# EAGLE design usb_hub_asic (EAGLE 9.6.2)
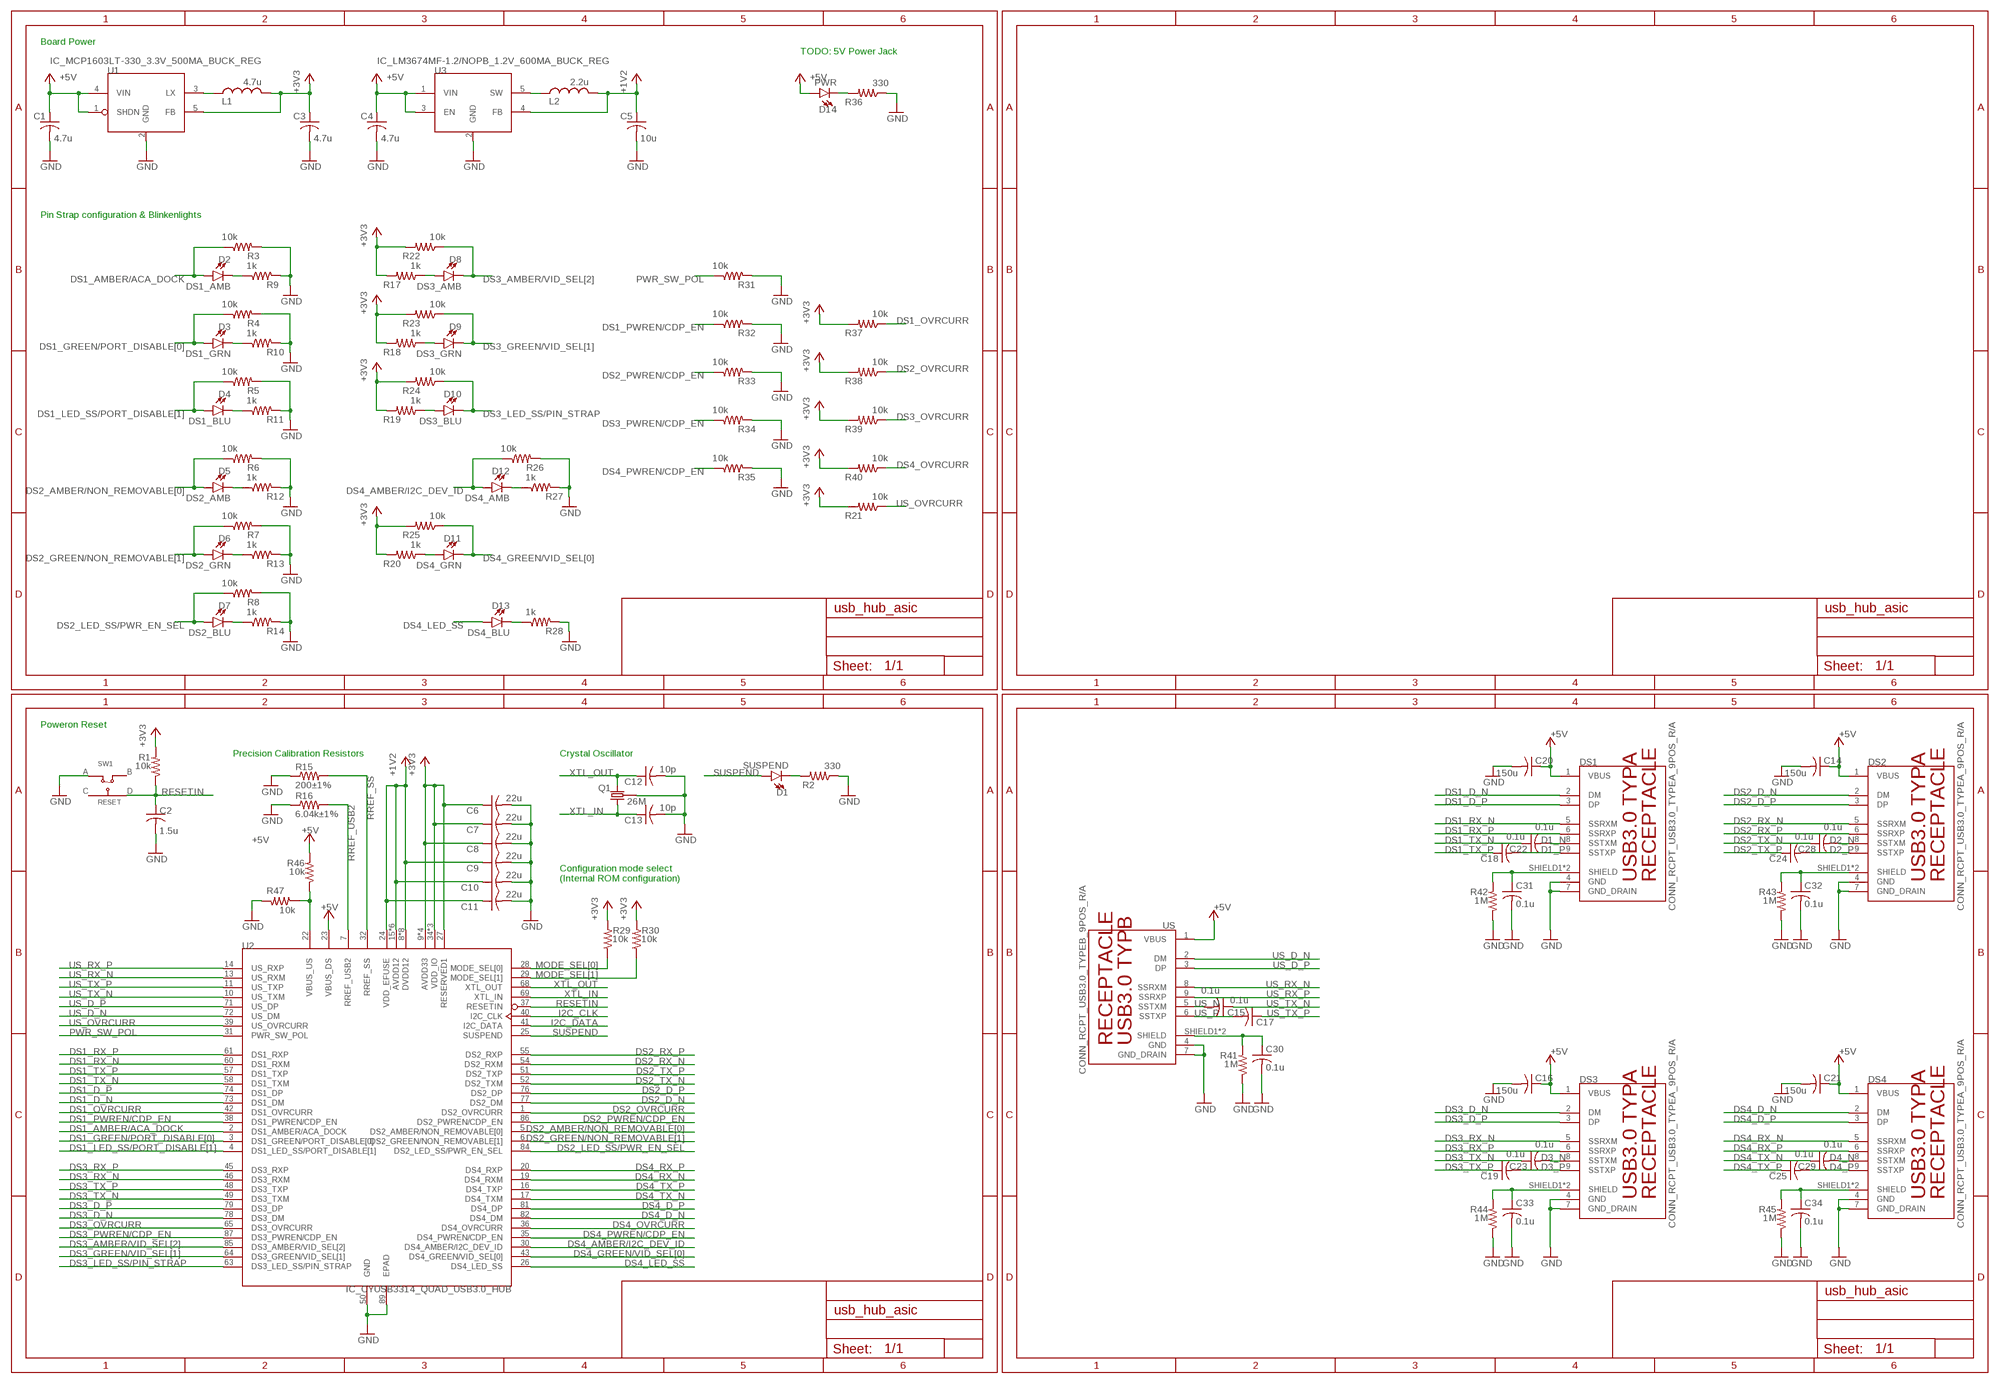
[diagram p0: schematic, sheet 1]

## Parts
C1  4.7u  C-USC0603  [C0603]
C2  1.5u  C-USC0603  [C0603]
C3  4.7u  C-USC0603  [C0603]
C4  4.7u  C-USC0603  [C0603]
C5  10u  C-USC0805  [C0805]
C6  22u  C-USC0603  [C0603]
C7  22u  C-USC0603  [C0603]
C8  22u  C-USC0603  [C0603]
C9  22u  C-USC0603  [C0603]
C10  22u  C-USC0603  [C0603]
C11  22u  C-USC0603  [C0603]
C12  10p  C-USC0603  [C0603]
C13  10p  C-USC0603  [C0603]
C14  150u  C-USC1210K  [C1210K]
C15  0.1u  C-USC0603  [C0603]
C16  150u  C-USC1210K  [C1210K]
C17  0.1u  C-USC0603  [C0603]
C18  0.1u  C-USC0603  [C0603]
C19  0.1u  C-USC0603  [C0603]
C20  150u  C-USC1210K  [C1210K]
C21  150u  C-USC1210K  [C1210K]
C22  0.1u  C-USC0603  [C0603]
C23  0.1u  C-USC0603  [C0603]
C24  0.1u  C-USC0603  [C0603]
C25  0.1u  C-USC0603  [C0603]
C28  0.1u  C-USC0603  [C0603]
C29  0.1u  C-USC0603  [C0603]
C30  0.1u  C-USC0603  [C0603]
C31  0.1u  C-USC0603  [C0603]
C32  0.1u  C-USC0603  [C0603]
C33  0.1u  C-USC0603  [C0603]
C34  0.1u  C-USC0603  [C0603]
D1  SUSPEND  LED1206  [LED-1206]
D2  DS1_AMB  LED-RED1206  [LED-1206]
D3  DS1_GRN  LED-GREEN1206  [LED-1206]
D4  DS1_BLU  LED-BLUE1206  [LED-1206]
D5  DS2_AMB  LED-RED1206  [LED-1206]
D6  DS2_GRN  LED-GREEN1206  [LED-1206]
D7  DS2_BLU  LED-BLUE1206  [LED-1206]
D8  DS3_AMB  LED-RED1206  [LED-1206]
D9  DS3_GRN  LED-GREEN1206  [LED-1206]
D10  DS3_BLU  LED-BLUE1206  [LED-1206]
D11  DS4_GRN  LED-GREEN1206  [LED-1206]
D12  DS4_AMB  LED-RED1206  [LED-1206]
D13  DS4_BLU  LED-BLUE1206  [LED-1206]
D14  PWR  LED1206  [LED-1206]
DS1  CONN_RCPT_USB3.0_TYPEA_9POS_R/A  [CONN_RCPT_USB3.0_UJ3-AH-4-TH]
DS2  CONN_RCPT_USB3.0_TYPEA_9POS_R/A  [CONN_RCPT_USB3.0_UJ3-AH-4-TH]
DS3  CONN_RCPT_USB3.0_TYPEA_9POS_R/A  [CONN_RCPT_USB3.0_UJ3-AH-4-TH]
DS4  CONN_RCPT_USB3.0_TYPEA_9POS_R/A  [CONN_RCPT_USB3.0_UJ3-AH-4-TH]
L1  4.7u  L_4.7UH_1.5A_SMD_1212(3030METRIC)  [SMD-1212(3030METRIC)]
L2  2.2u  L_2.2UH_1.3A_SMD_0805(2012METRIC)  [SMD-0805(2012METRIC)]
Q1  26M  XTAL_26MHZ_4-SMD_ECX-42  [4-SMD-ECS-260-13-42-CKM-TR]
R1  10k  R-US_R0603  [R0603]
R2  330  R-US_R0603  [R0603]
R3  10k  R-US_R0603  [R0603]
R4  10k  R-US_R0603  [R0603]
R5  10k  R-US_R0603  [R0603]
R6  10k  R-US_R0603  [R0603]
R7  10k  R-US_R0603  [R0603]
R8  10k  R-US_R0603  [R0603]
R9  1k  R-US_R0603  [R0603]
R10  1k  R-US_R0603  [R0603]
R11  1k  R-US_R0603  [R0603]
R12  1k  R-US_R0603  [R0603]
R13  1k  R-US_R0603  [R0603]
R14  1k  R-US_R0603  [R0603]
R15  200±1%  R-US_R0603  [R0603]
R16  6.04k±1%  R-US_R0603  [R0603]
R17  1k  R-US_R0603  [R0603]
R18  1k  R-US_R0603  [R0603]
R19  1k  R-US_R0603  [R0603]
R20  1k  R-US_R0603  [R0603]
R21  10k  R-US_R0603  [R0603]
R22  10k  R-US_R0603  [R0603]
R23  10k  R-US_R0603  [R0603]
R24  10k  R-US_R0603  [R0603]
R25  10k  R-US_R0603  [R0603]
R26  10k  R-US_R0603  [R0603]
R27  1k  R-US_R0603  [R0603]
R28  1k  R-US_R0603  [R0603]
R29  10k  R-US_R0603  [R0603]
R30  10k  R-US_R0603  [R0603]
R31  10k  R-US_R0603  [R0603]
R32  10k  R-US_R0603  [R0603]
R33  10k  R-US_R0603  [R0603]
R34  10k  R-US_R0603  [R0603]
R35  10k  R-US_R0603  [R0603]
R36  330  R-US_R0603  [R0603]
R37  10k  R-US_R0603  [R0603]
R38  10k  R-US_R0603  [R0603]
R39  10k  R-US_R0603  [R0603]
R40  10k  R-US_R0603  [R0603]
R41  1M  R-US_R0603  [R0603]
R42  1M  R-US_R0603  [R0603]
R43  1M  R-US_R0603  [R0603]
R44  1M  R-US_R0603  [R0603]
R45  1M  R-US_R0603  [R0603]
R46  10k  R-US_R0603  [R0603]
R47  10k  R-US_R0603  [R0603]
SW1  RESET  SW_SPDT_TLSMDT3C020GLFS  [SMD-TLSMDT3C020GLFS]
U1  IC_MCP1603LT-330_3.3V_500MA_BUCK_REG  [5-TSOT23]
U2  IC_CYUSB3314_QUAD_USB3.0_HUB  [88-QFN_10X10X1_5.3_TPAD]
U3  IC_LM3674MF-1.2/NOPB_1.2V_600MA_BUCK_REG  [5-TSOT23]
US  CONN_RCPT_USB3.0_TYPEB_9POS_R/A  [CONN_RCPT_USB3.0_E8199-030-03]

## Nets
+1V2: C5.1 C9.1 C10.1 C11.1 L2.P$2 U2.8(DVDD12) U2.12(DVDD12) U2.15(AVDD12) U2.18(DVDD12) U2.21(AVDD12) U2.24(VDD_EFUSE) U2.33(DVDD12) U2.44(AVDD12) U2.47(DVDD12) U2.53(DVDD12) U2.56(AVDD12) U2.59(DVDD12) U2.62(AVDD12) U2.67(AVDD12) U2.83(DVDD12) U3.4(FB)
+3V3: C3.1 C6.1 C7.1 C8.1 L1.P$2 R1.2 R17.2 R18.2 R19.2 R20.2 R21.2 R22.2 R23.2 R24.2 R25.2 R29.2 R30.2 R37.2 R38.2 R39.2 R40.2 U1.5(FB) U2.9(AVDD33) U2.27(RESERVED1) U2.34(VDD_IO) U2.66(VDD_IO) U2.70(AVDD33) U2.75(AVDD33) U2.80(AVDD33) U2.88(VDD_IO)
+5V: C1.1 C4.1 C14.1 C16.1 C20.1 C21.1 D14.A DS1.1(VBUS) DS2.1(VBUS) DS3.1(VBUS) DS4.1(VBUS) R46.2 U1.1(SHDN) U1.4(VIN) U2.23(VBUS_DS) U3.1(VIN) U3.3(EN) US.1(VBUS)
D1_N: C22.2 DS1.8(SSTXM)
D1_P: C18.2 DS1.9(SSTXP)
D2_N: C28.2 DS2.8(SSTXM)
D2_P: C24.2 DS2.9(SSTXP)
D3_N: C23.2 DS3.8(SSTXM)
D3_P: C19.2 DS3.9(SSTXP)
D4_N: C29.2 DS4.8(SSTXM)
D4_P: C25.2 DS4.9(SSTXP)
DS1_AMBER/ACA_DOCK: D2.A R3.1 U2.2(DS1_AMBER/ACA_DOCK)
DS1_D_N: DS1.2(DM) U2.73(DS1_DM)
DS1_D_P: DS1.3(DP) U2.74(DS1_DP)
DS1_GREEN/PORT_DISABLE[0]: D3.A R4.1 U2.3(DS1_GREEN/PORT_DISABLE[0])
DS1_LED_SS/PORT_DISABLE[1]: D4.A R5.1 U2.4(DS1_LED_SS/PORT_DISABLE[1])
DS1_OVRCURR: R37.1 U2.42(DS1_OVRCURR)
DS1_PWREN/CDP_EN: R32.1 U2.38(DS1_PWREN/CDP_EN)
DS1_RX_N: DS1.5(SSRXM) U2.60(DS1_RXM)
DS1_RX_P: DS1.6(SSRXP) U2.61(DS1_RXP)
DS1_TX_N: C22.1 U2.58(DS1_TXM)
DS1_TX_P: C18.1 U2.57(DS1_TXP)
DS2_AMBER/NON_REMOVABLE[0]: D5.A R6.1 U2.5(DS2_AMBER/NON_REMOVABLE[0])
DS2_D_N: DS2.2(DM) U2.77(DS2_DM)
DS2_D_P: DS2.3(DP) U2.76(DS2_DP)
DS2_GREEN/NON_REMOVABLE[1]: D6.A R7.1 U2.6(DS2_GREEN/NON_REMOVABLE[1])
DS2_LED_SS/PWR_EN_SEL: D7.A R8.1 U2.84(DS2_LED_SS/PWR_EN_SEL)
DS2_OVRCURR: R38.1 U2.1(DS2_OVRCURR)
DS2_PWREN/CDP_EN: R33.1 U2.86(DS2_PWREN/CDP_EN)
DS2_RX_N: DS2.5(SSRXM) U2.54(DS2_RXM)
DS2_RX_P: DS2.6(SSRXP) U2.55(DS2_RXP)
DS2_TX_N: C28.1 U2.52(DS2_TXM)
DS2_TX_P: C24.1 U2.51(DS2_TXP)
DS3_AMBER/VID_SEL[2]: D8.C R22.1 U2.85(DS3_AMBER/VID_SEL[2])
DS3_D_N: DS3.2(DM) U2.78(DS3_DM)
DS3_D_P: DS3.3(DP) U2.79(DS3_DP)
DS3_GREEN/VID_SEL[1]: D9.C R23.1 U2.64(DS3_GREEN/VID_SEL[1])
DS3_LED_SS/PIN_STRAP: D10.C R24.1 U2.63(DS3_LED_SS/PIN_STRAP)
DS3_OVRCURR: R39.1 U2.65(DS3_OVRCURR)
DS3_PWREN/CDP_EN: R34.1 U2.87(DS3_PWREN/CDP_EN)
DS3_RX_N: DS3.5(SSRXM) U2.46(DS3_RXM)
DS3_RX_P: DS3.6(SSRXP) U2.45(DS3_RXP)
DS3_TX_N: C23.1 U2.49(DS3_TXM)
DS3_TX_P: C19.1 U2.48(DS3_TXP)
DS4_AMBER/I2C_DEV_ID: D12.A R26.1 U2.30(DS4_AMBER/I2C_DEV_ID)
DS4_D_N: DS4.2(DM) U2.82(DS4_DM)
DS4_D_P: DS4.3(DP) U2.81(DS4_DP)
DS4_GREEN/VID_SEL[0]: D11.C R25.1 U2.43(DS4_GREEN/VID_SEL[0])
DS4_LED_SS: D13.A U2.26(DS4_LED_SS)
DS4_OVRCURR: R40.1 U2.36(DS4_OVRCURR)
DS4_PWREN/CDP_EN: R35.1 U2.35(DS4_PWREN/CDP_EN)
DS4_RX_N: DS4.5(SSRXM) U2.19(DS4_RXM)
DS4_RX_P: DS4.6(SSRXP) U2.20(DS4_RXP)
DS4_TX_N: C29.1 U2.17(DS4_TXM)
DS4_TX_P: C25.1 U2.16(DS4_TXP)
GND: C1.2 C2.2 C3.2 C4.2 C5.2 C6.2 C7.2 C8.2 C9.2 C10.2 C11.2 C12.2 C13.2 C14.2 C16.2 C20.2 C21.2 C30.2 C31.2 C32.2 C33.2 C34.2 DS1.4(GND) DS1.7(GND_DRAIN) DS2.4(GND) DS2.7(GND_DRAIN) DS3.4(GND) DS3.7(GND_DRAIN) DS4.4(GND) DS4.7(GND_DRAIN) Q1.P$2(GND) Q1.P$4(GND) R2.1 R3.2 R4.2 R5.2 R6.2 R7.2 R8.2 R9.2 R10.2 R11.2 R12.2 R13.2 R14.2 R15.1 R16.1 R26.2 R27.2 R28.2 R31.2 R32.2 R33.2 R34.2 R35.2 R36.1 R41.1 R42.1 R43.1 R44.1 R45.1 R47.2 SW1.A U1.2(GND) U2.50(GND) U2.89(EPAD) U3.2(GND) US.4(GND) US.7(GND_DRAIN)
I2C_CLK: U2.40(I2C_CLK)
I2C_DATA: U2.41(I2C_DATA)
MODE_SEL[0]: R29.1 U2.28(MODE_SEL[0])
MODE_SEL[1]: R30.1 U2.29(MODE_SEL[1])
N$7: D1.C R2.2
N$8: D14.C R36.2
N$11: D2.C R9.1
N$15: D5.C R12.1
N$16: D3.C R10.1
N$20: D6.C R13.1
N$21: D4.C R11.1
N$23: D7.C R14.1
N$24: D10.A R19.1
N$25: D9.A R18.1
N$26: D8.A R17.1
N$27: D12.C R27.1
N$28: L2.P$1 U3.5(SW)
N$29: D13.C R28.1
N$30: L1.P$1 U1.3(LX)
N$32: D11.A R20.1
N$36: R46.1 R47.1 U2.22(VBUS_US)
N$37: C30.1 R41.2 US.SHIELD1(SHIELD) US.SHIELD2(SHIELD)
N$38: C31.1 DS1.SHIELD1(SHIELD) DS1.SHIELD2(SHIELD) R42.2
N$39: C32.1 DS2.SHIELD1(SHIELD) DS2.SHIELD2(SHIELD) R43.2
N$40: C33.1 DS3.SHIELD1(SHIELD) DS3.SHIELD2(SHIELD) R44.2
N$41: C34.1 DS4.SHIELD1(SHIELD) DS4.SHIELD2(SHIELD) R45.2
PWR_SW_POL: R31.1 U2.31(PWR_SW_POL)
RESETIN: C2.1 R1.1 SW1.D U2.37(RESETIN)
RREF_SS: R15.2 U2.32(RREF_SS)
RREF_USB2: R16.2 U2.7(RREF_USB2)
SUSPEND: D1.A U2.25(SUSPEND)
US_D_N: U2.72(US_DM) US.2(DM)
US_D_P: U2.71(US_DP) US.3(DP)
US_N: C15.2 US.5(SSTXM)
US_OVRCURR: R21.1 U2.39(US_OVRCURR)
US_P: C17.2 US.6(SSTXP)
US_RX_N: U2.13(US_RXM) US.8(SSRXM)
US_RX_P: U2.14(US_RXP) US.9(SSRXP)
US_TX_N: C15.1 U2.10(US_TXM)
US_TX_P: C17.1 U2.11(US_TXP)
XTL_IN: C13.1 Q1.P$1 U2.69(XTL_IN)
XTL_OUT: C12.1 Q1.P$3 U2.68(XTL_OUT)
Unconnected: SW1.B SW1.C

## Notes on the sheet
- Board Power
- TODO: 5V Power Jack
- Pin Strap configuration & Blinkenlights
- Poweron Reset
- Precision Calibration Resistors | Crystal Oscillator
- Configuration mode select
  (Internal ROM configuration)

## Library data of the parts
C1-C25 C28-C34 = rcl:C-US: CAPACITOR, American symbol; SPICEPREFIX: C
D1 D14 = SparkFun-LED:LED: LED (Generic) Standard schematic elements and footprints for 5mm, 3mm, 1206, and 0603 sized LEDs. Generic LEDs with no color specified.
D2 D5 D8 D12 = SparkFun-LED:LED-RED: Red SMD LED Used in manufacturing of most products at SparkFun Packages: 0603 - SMD 0603 package [Product Link] <http://docs.avagotech.com/docs/AV02-0551EN> 0603 SMART - SMD 0603 SMART package ( more efficient and expensive)[Product Link] <http://www.osram-os.com/Graphics/XPic2/00077099_0.pdf> 1206 - SMD1206 package [Product Link] <https://www.sparkfun.com/datasheets/DevTools/LilyPad/Q150OVS4.pdff> SparkFun Products: Pro Mini 328 -5V <https://www.sparkfun.com/products/821> RedBoard <https://www.sparkfun.com/products/12757> IOIO-OTG <https://www.sparkfun.com/products/13613>; PROD_ID: DIO-09912; VALUE: RED
D3 D6 D9 D11 = SparkFun-LED:LED-GREEN: Green SMD LED Used in manufacturing of various products at SparkFun Packages: 0603 - SMD 0603 package [Product Link] <http://www.futureelectronics.com/en/technologies/semiconductors/optoelectronics/leds/Pages/9894312-LTST-C190GKT.aspx?CrossPart=HSMG-C190&IM=0> LilyPad 1206 - SMD1206 LilyPad package [Product Link] <http://www.futureelectronics.com/en/Technologies/Product.aspx?ProductID=IN150NGHARVATEKCORPORATION2049943&IM=0> 1206 - SMD1206 package [Product Link] <http://www.futureelectronics.com/en/technologies/semiconductors/optoelectronics/leds/Pages/8315665-LTST-C150KGKT.aspx?IM=0> 1206 Bottom Mount -SMD 1206 Bottom Mount [Product Link] <http://www.digikey.com/product-detail/en/lite-on-inc/LTST-C230KGKT/160-1456-1-ND/386854> SparkFun Products: Pro Mini 328 -5V <https://www.sparkfun.com/products/821> RedBoard <https://www.sparkfun.com/products/12757> MP3 Trigger <https://www.sparkfun.com/products/13720> Makey Makey <https://www.sparkfun.com/products/11076>; PROD_ID: DIO-00862; VALUE: GREEN
D4 D7 D10 D13 = SparkFun-LED:LED-BLUE: Blue SMD LED Used in manufacturing of various products at SparkFun Packages: 0603 - SMD 0603 package [Product Link] <http://www.digikey.com/product-detail/en/SMLE12BC7TT86/511-1589-2-ND/1641808> 1206 - SMD1206 package [Product Link] <http://www.digikey.com/product-detail/en/lite-on-inc/LTST-C150TBKT/160-1643-1-ND/573584> SparkFun Products: ESP8266 Thing-Dev Board <https://www.sparkfun.com/products/13711> RedBoard <https://www.sparkfun.com/products/12757>; PROD_ID: DIO-09911; VALUE: BLUE
DS1-DS4 = USB_Hub_ASIC:CONN_RCPT_USB3.0_TYPEA_9POS_R/A: CONN RCPT USB3.0 TYPEA 9POS R/A CUI Devices USB 3.0 Type A Receptacle https://www.cuidevices.com/product/resource/uj3-ah-4-th.pdf https://www.digikey.com/en/products/detail/cui-devices/UJ3-AH-4-TH/6187912
L1 = USB_Hub_ASIC:L_4.7UH_1.5A_SMD_1212(3030METRIC): 4.7 µH Shielded Molded Inductor 1.5 A 162mOhm Max 1212 (3030 Metric) https://www.digikey.com/en/products/detail/w%C3%BCrth-elektronik/74438335047/4386836 https://www.we-online.com/katalog/datasheet/74438335047.pdf
L2 = USB_Hub_ASIC:L_2.2UH_1.3A_SMD_0805(2012METRIC): 2.2 µH Shielded Molded Inductor 1.3 A 176mOhm Max 0805 (2012 Metric) https://www.digikey.com/en/products/detail/w%C3%BCrth-elektronik/74479275222/5870514 https://www.we-online.com/katalog/datasheet/74479275222.pdf
Q1 = USB_Hub_ASIC:XTAL_26MHZ_4-SMD_ECX-42: 26 MHz ±10ppm Crystal 13pF 40 Ohms 4-SMD, No Lead https://www.digikey.com/en/products/detail/ecs-inc/ECS-260-13-42-CKM-TR/1693554 https://ecsxtal.com/store/pdf/ECX_42.pdf
R1-R47 = rcl:R-US_: RESISTOR, American symbol; SPICEPREFIX: R
SW1 = USB_Hub_ASIC:SW_SPDT_TLSMDT3C020GLFS: Tactile Switch SPDT Top Actuated Surface Mount https://www.digikey.com/en/products/detail/c-k/TLSM-D-T3-C-020-G-LFS/14553425 https://www.ckswitches.com/media/3238/ck_tlsm_datasheet.pdf
U1 = USB_Hub_ASIC:IC_MCP1603LT-330_3.3V_500MA_BUCK_REG: IC REG BUCK 3.3V 500MA TSOT23-5 Buck Switching Regulator IC Positive Fixed 3.3V 1 Output 500mA SOT-23-5 Thin, TSOT-23-5 https://www.digikey.com/en/products/detail/microchip-technology/MCP1603LT-330I-OS/1098419 https://ww1.microchip.com/downloads/en/DeviceDoc/22042B.pdf
U2 = USB_Hub_ASIC:IC_CYUSB3314_QUAD_USB3.0_HUB
U3 = USB_Hub_ASIC:IC_LM3674MF-1.2/NOPB_1.2V_600MA_BUCK_REG: IC REG BUCK 1.2V 600MA SOT23-5 Buck Switching Regulator IC Positive Fixed 1.2V 1 Output 600mA SC-74A, SOT-753 https://www.digikey.com/en/products/detail/texas-instruments/LM3674MF-1-2-NOPB/1590072 https://www.ti.com/lit/ds/symlink/lm3674.pdf?HQS=dis-dk-null-digikeymode-dsf-pf-null-wwe&ts=1666829327772&ref_url=https%253A%252F%252Fwww.ti.com%252Fgeneral%252Fdocs%252Fsuppproductinfo.tsp%253FdistId%253D10%2526gotoUrl%253Dhttps%253A%252F%252Fwww.ti.com%252Flit%252Fgpn%252Flm3674
US = USB_Hub_ASIC:CONN_RCPT_USB3.0_TYPEB_9POS_R/A: CONN RCPT USB3.0 TYPEA 9POS R/A CUI Devices USB 3.0 Type A Receptacle https://media.digikey.com/pdf/Data%20Sheets/Pulse%20PDFs/E8199-030-03-Model_DS.pdf https://www.digikey.com/en/products/detail/pulse-electronics-network/E8199-030-03/13561267

## Board
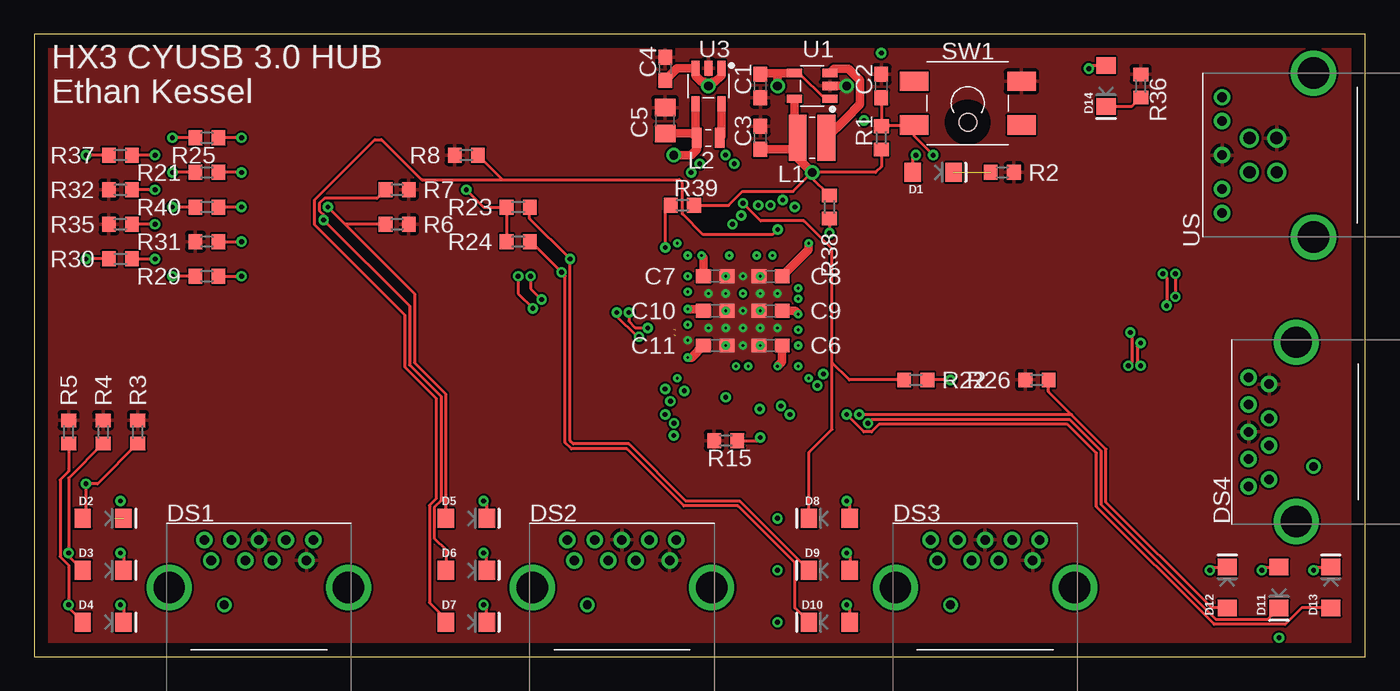
[diagram p1: board, top side]
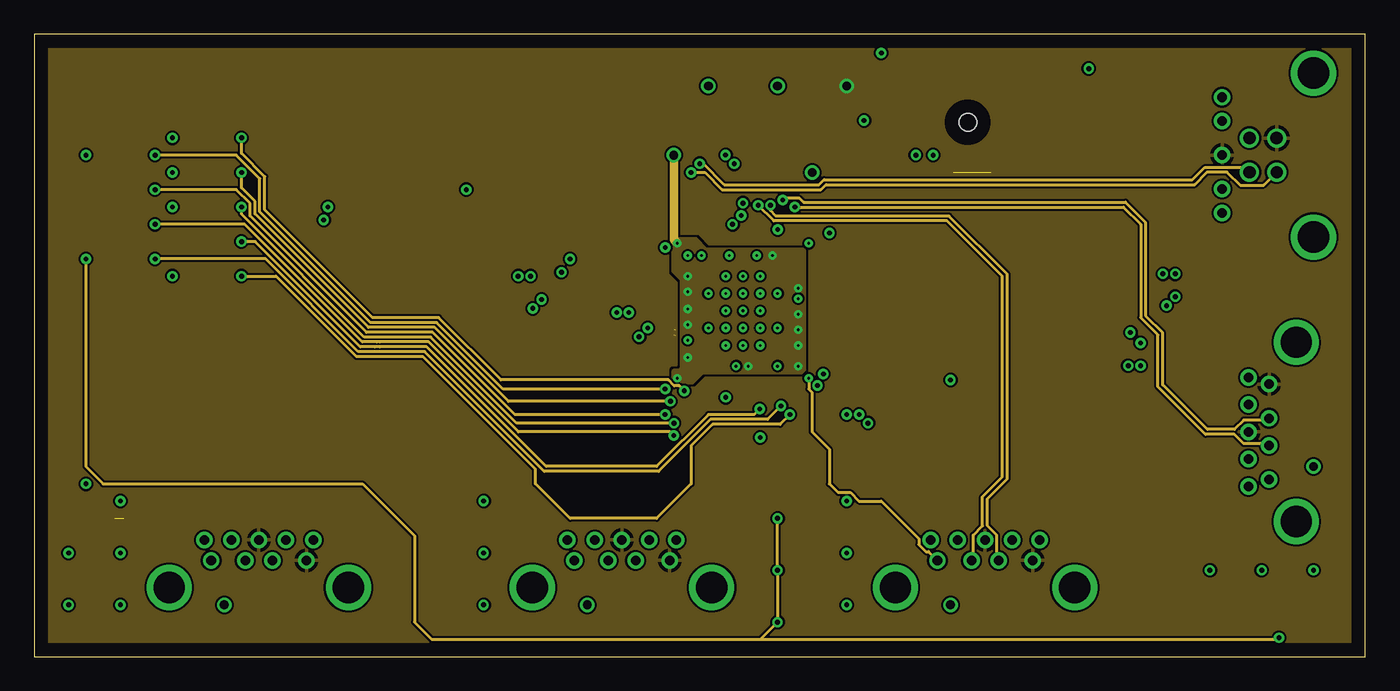
[diagram p2: board, inner layer Route2]
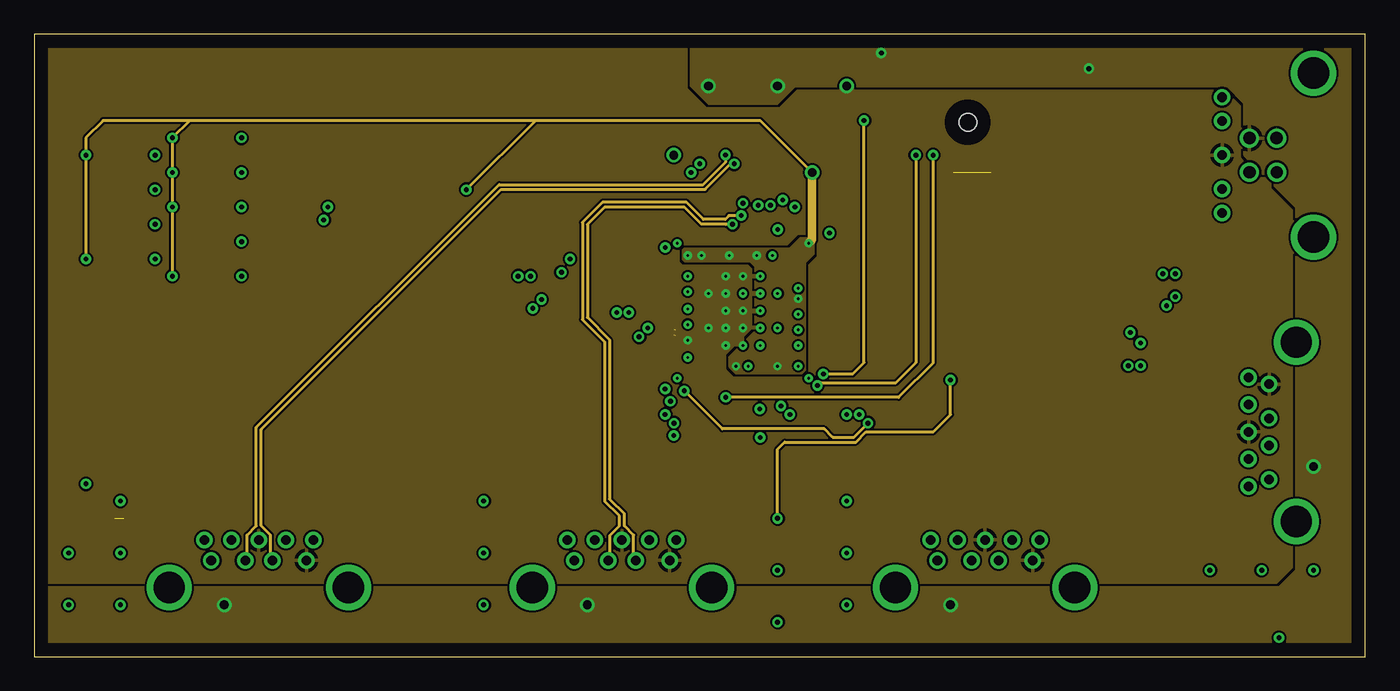
[diagram p3: board, inner layer Route15]
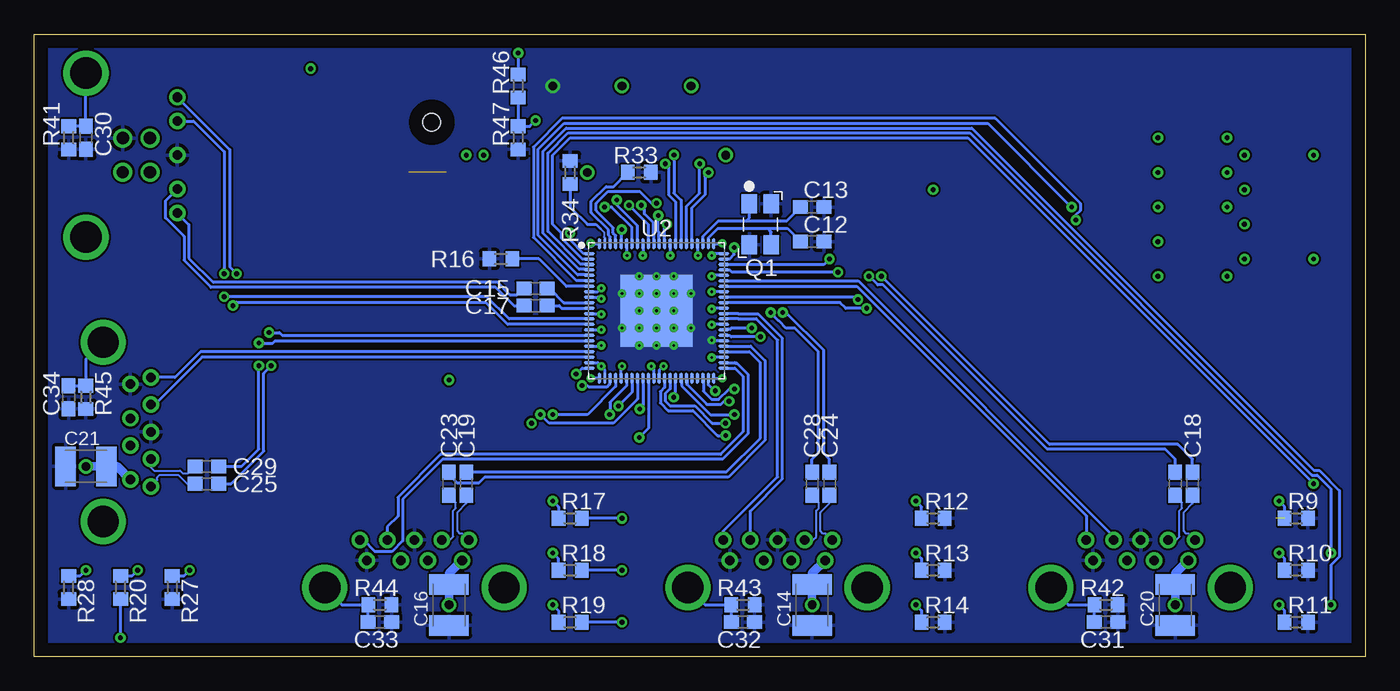
[diagram p4: board, bottom side, seen from below]

Size 97.79 x 45.72 mm. Coordinates in mm from the lower left corner, seen from the top.
Outline: 0,0 97.79,0 97.79,45.72 0,45.72 0,0
Copper layers (1+2*15+16): Top 0.06858125mm / dielectric 0.10921875mm / Route2 0.03301875mm / dielectric 0.11556875mm / Route15 0.03301875mm / dielectric 0.10921875mm / Bottom 0.06858125mm
Design rules "default *": minimum track width 6mil, minimum drill 0.35mm, track to track 6mil, track to pad 6mil, pad to pad 6mil, via to via 6mil, smd to smd 6mil, copper to edge 40mil, drill to drill 6mil, minimum pad ring 10mil, minimum via ring 8mil, stop-mask expansion 4mil, vias tented up to drill 0mil, thermal gap 10mil

### Footprints (pad centres in the part's own frame; a part is rotated, then mirrored left to right if it is on the bottom)
C0603 = smd 1.1 x 1: 1 -0.85,0; 2 0.85,0
C0805 = smd 1.3 x 1.5: 1 -0.95,0; 2 0.95,0
C1210K = smd 1.5 x 2.9: 1 -1.5,0; 2 1.5,0
LED-1206 = smd 1.2 x 1.4: A -1.5,0; C 1.5,0
CONN_RCPT_USB3.0_UJ3-AH-4-TH = drill 0.7: 1 -3.5,2; 2 -1,2; 3 1,2; 4 3.5,2; 5 4,3.5; 6 2,3.5; 7 0,3.5; 8 -2,3.5; 9 -4,3.5 | drill 2.3: SHIELD1 6.585,0; SHIELD2 -6.585,0
SMD-1212(3030METRIC) = smd 1.3 x 3.4: P$1 -1.05,0; P$2 1.05,0
SMD-0805(2012METRIC) = smd 0.7 x 1.45: P$1 -0.85,0; P$2 0.85,0
4-SMD-ECS-260-13-42-CKM-TR = smd 1.4 x 1.15: P$1 -1.5,-0.8; P$2 1.5,-0.8; P$3 1.5,0.8; P$4 -1.5,0.8
R0603 = smd 1 x 1.1: 1 -0.85,0; 2 0.85,0
SMD-TLSMDT3C020GLFS = smd 2.1 x 1.4: A -3.95,-1.6; B 3.95,-1.6; C -3.95,1.6; D 3.95,1.6 | hole 1.3: 0,1.4
5-TSOT23 = smd 0.6 x 1.1: 1 -0.95,-1.3; 2 0,-1.3; 3 0.95,-1.3; 4 0.95,1.3; 5 -0.95,1.3
88-QFN_10X10X1_5.3_TPAD = smd 0.837 x 0.22: 1 -4.937,4.2; 2 -4.937,3.8; 3 -4.937,3.4; 4 -4.937,3; 5 -4.937,2.6; 6 -4.937,2.2; 7 -4.937,1.8; 8 -4.937,1.4; 9 -4.937,1; 10 -4.937,0.6; 11 -4.937,0.2; 12 -4.937,-0.2; 13 -4.937,-0.6; 14 -4.937,-1; 15 -4.937,-1.4; 16 -4.937,-1.8; 17 -4.937,-2.2; 18 -4.937,-2.6; 19 -4.937,-3; 20 -4.937,-3.4; 21 -4.937,-3.8; 22 -4.937,-4.2; 45 4.937,-4.2; 46 4.937,-3.8; 47 4.937,-3.4; 48 4.937,-3; 49 4.937,-2.6; 50 4.937,-2.2; 51 4.937,-1.8; 52 4.937,-1.4; 53 4.937,-1; 54 4.937,-0.6; 55 4.937,-0.2; 56 4.937,0.2; 57 4.937,0.6; 58 4.937,1; 59 4.937,1.4; 60 4.937,1.8; 61 4.937,2.2; 62 4.937,2.6; 63 4.937,3; 64 4.937,3.4; 65 4.937,3.8; 66 4.937,4.2 | smd 0.22 x 0.837: 23 -4.2,-4.937; 24 -3.8,-4.937; 25 -3.4,-4.937; 26 -3,-4.937; 27 -2.6,-4.937; 28 -2.2,-4.937; 29 -1.8,-4.937; 30 -1.4,-4.937; 31 -1,-4.937; 32 -0.6,-4.937; 33 -0.2,-4.937; 34 0.2,-4.937; 35 0.6,-4.937; 36 1,-4.937; 37 1.4,-4.937; 38 1.8,-4.937; 39 2.2,-4.937; 40 2.6,-4.937; 41 3,-4.937; 42 3.4,-4.937; 43 3.8,-4.937; 44 4.2,-4.937; 67 4.2,4.937; 68 3.8,4.937; 69 3.4,4.937; 70 3,4.937; 71 2.6,4.937; 72 2.2,4.937; 73 1.8,4.937; 74 1.4,4.937; 75 1,4.937; 76 0.6,4.937; 77 0.2,4.937; 78 -0.2,4.937; 79 -0.6,4.937; 80 -1,4.937; 81 -1.4,4.937; 82 -1.8,4.937; 83 -2.2,4.937; 84 -2.6,4.937; 85 -3,4.937; 86 -3.4,4.937; 87 -3.8,4.937; 88 -4.2,4.937 | smd 5.3 x 5.3: 89 0,0
CONN_RCPT_USB3.0_E8199-030-03 = drill 0.9: 1 1.25,4.71; 2 -1.25,4.71; 3 -1.25,2.71; 4 1.25,2.713 | drill 0.7: 5 -4.25,6.71; 6 -2.5,6.71; 7 0,6.71; 8 2.5,6.71; 9 4.25,6.71 | drill 2.3: SHIELD1 6.02,0; SHIELD2 -6.02,0

### Placement (x,y rotation side)
C1  53.34,41.91 270 top
C2  62.23,41.91 90 top
C3  53.34,38.1 90 top
C4  46.35,43.18 90 top
C5  46.35,39.37 90 top
C6  54.1,22.86 180 top
C7  50.04,27.94 0 top
C8  54.1,27.94 180 top
C9  54.1,25.4 180 top
C10  50.04,25.4 0 top
C11  50.04,22.86 0 top
C12  40.64,30.48 0 bottom
C13  40.64,33.02 0 bottom
C14  40.64,3.81 270 bottom
C15  60.96,27.05 180 bottom
C16  67.31,3.81 270 bottom
C17  60.96,25.78 180 bottom
C18  12.7,12.7 270 bottom
C19  66.04,12.7 270 bottom
C20  13.97,3.81 270 bottom
C21  93.98,13.97 180 bottom
C22  13.97,12.7 270 bottom
C23  67.31,12.7 270 bottom
C24  39.37,12.7 270 bottom
C25  85.09,12.7 180 bottom
C28  40.64,12.7 270 bottom
C29  85.09,13.97 180 bottom
C30  93.98,38.1 270 bottom
C31  19.05,2.54 0 bottom
C32  45.72,2.54 0 bottom
C33  72.39,2.54 0 bottom
C34  95.25,19.05 270 bottom
D1  66.04,35.56 0 top
D2  5.08,10.16 0 top
D3  5.08,6.35 0 top
D4  5.08,2.54 0 top
D5  31.75,10.16 0 top
D6  31.75,6.35 0 top
D7  31.75,2.54 0 top
D8  58.42,10.16 180 top
D9  58.42,6.35 180 top
D10  58.42,2.54 180 top
D11  91.44,5.08 270 top
D12  87.63,5.08 90 top
D13  95.25,5.08 90 top
D14  78.74,41.91 270 top
DS1  16.51,5.08 0 top
DS2  43.18,5.08 0 top
DS3  69.85,5.08 0 top
DS4  92.71,16.51 90 top
L1  57.15,38.1 180 top
L2  49.53,38.1 180 top
Q1  44.45,31.75 270 bottom
R1  62.23,38.1 270 top
R2  71.12,35.56 180 top
R3  7.62,16.51 90 top
R4  5.08,16.51 90 top
R5  2.54,16.51 90 top
R6  26.67,31.75 0 top
R7  26.67,34.29 0 top
R8  31.75,36.83 180 top
R9  5.08,10.16 0 bottom
R10  5.08,6.35 0 bottom
R11  5.08,2.54 0 bottom
R12  31.75,10.16 0 bottom
R13  31.75,6.35 0 bottom
R14  31.75,2.54 0 bottom
R15  50.8,15.88 0 top
R16  63.5,29.21 0 bottom
R17  58.42,10.16 0 bottom
R18  58.42,6.35 0 bottom
R19  58.42,2.54 0 bottom
R20  91.44,5.08 270 bottom
R21  12.7,35.56 180 top
R22  64.77,20.32 0 top
R23  35.56,33.02 180 top
R24  35.56,30.48 180 top
R25  12.7,38.1 180 top
R26  73.66,20.32 180 top
R27  87.63,5.08 270 bottom
R28  95.25,5.08 270 bottom
R29  12.7,27.94 180 top
R30  6.35,29.21 180 top
R31  12.7,30.48 180 top
R32  6.35,34.29 180 top
R33  53.34,35.56 0 bottom
R34  58.42,35.56 90 bottom
R35  6.35,31.75 180 top
R36  81.28,41.91 270 top
R37  6.35,36.83 180 top
R38  58.42,33.02 90 top
R39  47.62,33.15 0 top
R40  12.7,33.02 180 top
R41  95.25,38.1 90 bottom
R42  19.05,3.81 180 bottom
R43  45.72,3.81 180 bottom
R44  72.39,3.81 180 bottom
R45  93.98,19.05 90 bottom
R46  62.23,41.91 90 bottom
R47  62.23,38.1 270 bottom
SW1  68.58,40.64 180 top
U1  57.15,41.91 90 top
U2  52.07,25.4 0 bottom
U3  49.53,41.91 180 top
US  93.98,36.83 90 top

### Tracks (layer width: path | path; a pad name or v marks a point on that pad's centre or on a via)
+1V2  (via drill 0.2 pad 0.41, 0.65)
  Top 0.305: C10.1 49.06,25.53
  Top 0.61: 49.06,25.53 v48.01,25.53 | C9.1 55.88,25.4 v56.13,25.15 | C11.1 48.3,21.97 v48.01,21.97 | C5.1 48.36,38.42 L2.P$2 | L2.P$2 48.68,37.25 48.26,36.83 v46.99,36.83 | U3.4 48.58,38.2 L2.P$2
  Route2 0.61: v47.24,30.35 46.99,30.61 v46.99,36.83
  Bottom 0.203: U2.83 54.27,29.5 v54.23,29.46 | U2.67 47.26,30.34 v47.24,30.35 | U2.62 47.95,28 v48.01,27.94 | U2.59 v48,26.8 v48.01,26.8 | U2.56 47.93,25.6 v48.01,25.53 | U2.53 47.99,24.4 v48.01,24.38 | U2.47 47.98,22 v48.01,21.97 | U2.44 47.85,20.45 v47.24,20.45 | U2.33 52.27,21.16 v52.45,21.34 | U2.21 56.4,21.6 v56.13,21.34 55.87,21.07 U2.24 | U2.18 56.19,22.8 v56.13,22.86 | U2.15 v56.14,24 v56.13,24 | U2.12 56.19,25.2 v56.13,25.15 | U2.8 56.38,26.8 v56.13,27.05
  pour Route2 (rank 2): 46.99,30.73 46.86,30.61 46.86,28.32 47.5,27.69 47.5,21.21 47.37,21.08 46.99,21.08 46.86,20.95 46.86,20.19 46.99,20.07 48.39,20.07 49.15,20.83 56.39,20.83 56.64,21.08 56.64,29.84 56.52,29.97 49.4,29.97 48.64,30.73
+3V3  (via drill 0.2, 0.2 pad 0.41, 0.35, 0.65)
  Top 0.203: R1.2 62.23,35.98 61.81,35.56 v57.15,35.56 | R38.2 57.15,35.14 v57.15,35.56 | R39.2 51.02,33.15 52.04,34.17 55.76,34.17 v57.15,35.56 | v31.75,34.29 33.02,33.02 R23.2 R24.2 | R25.2 v10.16,38.1 | R21.2 v10.16,35.56 | R40.2 v10.16,33.02 | R29.2 v10.16,27.94 | R37.2 v3.81,36.83 | R30.2 v3.81,29.21 | v67.31,20.32 R22.2
  Top 0.61: C7.1 49.19,29.3 v49.02,29.46 | C6.1 54.95,21.68 v54.61,21.34 | C8.1 56.9,29.88 v56.9,30.35 | L1.P$2 56.1,36.83 55.68,37.25 C3.1 | U1.5 55.85,38.35 L1.P$2 | L1.P$2 56.1,36.61 v57.15,35.56
  Route2 0.203: v3.81,29.21 3.81,13.97 5.08,12.7 24.13,12.7 27.94,8.89 27.94,2.54 29.21,1.27 53.34,1.27 | 53.34,1.27 v54.61,2.54 v54.61,6.35 v54.61,10.16 | 53.34,1.27 91.44,1.27 v91.44,1.39
  Route15 0.203: v57.15,35.56 53.34,39.37 36.83,39.37 | v31.75,34.29 36.83,39.37 | 36.83,39.37 11.43,39.37 | 11.43,39.37 v10.16,38.1 v10.16,35.56 v10.16,33.02 v10.16,27.94 | 11.43,39.37 5.08,39.37 3.81,38.1 v3.81,36.83 v3.81,29.21 | v54.61,10.16 54.61,15.24 55.14,15.77 60.37,15.77 61.12,16.51 66.04,16.51 67.31,17.78 v67.31,20.32
  Route15 0.61: v57.15,35.56 57.15,30.61 v56.9,30.35
  Bottom 0.203: v56.9,30.35 56.88,30.34 U2.88 | U2.80 53.07,29.48 v53.09,29.46 | U2.75 51.07,29.48 v51.05,29.46 | U2.70 49.07,29.51 v49.02,29.46 | U2.66 47.87,29.6 v48.01,29.46 | U2.34 51.87,21.03 v51.56,21.34 | U2.27 54.67,21.28 v54.61,21.34 | U2.9 56.4,26.4 56.37,26.37 56.21,26.37 v56.13,26.29 | v91.44,1.39 R20.2 | v54.61,2.54 R19.2 | v54.61,6.35 R18.2 | v54.61,10.16 R17.2
  Bottom 0.61: 56.93,30.39 56.88,30.34
  pour Route15 (rank 2): 47.75,29.97 47.62,29.84 47.62,20.95 47.75,20.83 56.39,20.83 56.64,21.08 56.64,28.96 57.28,29.59 57.28,30.61 57.15,30.73 56.26,30.73 55.5,29.97
+5V  (via drill 0.2 pad 0.41, 0.35, 0.65)
  Top 0.203: U1.4 56.2,42.86 58.1,40.96 U1.1 | D14.A 77.7,43.41 v77.47,43.18
  Top 0.61: U1.4 54.61,42.86 | 54.61,42.86 53.44,42.86 C1.1 | 54.61,42.86 v54.61,41.91 | U3.1 50.48,42.66 50.02,42.2 49.82,42.2 v49.53,41.91 49.24,42.2 49.04,42.2 48.58,42.66 U3.3 47.23,43.21 C4.1
  Route2 0.203: v56.9,20.45 56.91,20.43 56.91,19.65 57.15,19.41 57.15,16.51 58.42,15.24 58.42,12.7 59.06,12.06 59.95,12.06 60.58,11.43 62.23,11.43 64.99,8.67 64.99,8.22 65.5,7.72 65.71,7.72 DS3.1
  Bottom 0.203: U2.23 56.88,20.46 v56.9,20.45 | v62.23,44.33 R46.2
  Bottom 0.61: DS1.1 13.97,6.12 C20.1 v13.97,3.81 | DS4.1 91.67,13.97 C21.1 v93.98,13.97 | DS2.1 40.64,6.12 C14.1 v40.64,3.81 | DS3.1 67.31,6.12 C16.1 v67.31,3.81
  pour Route15 (rank 3): 0,5.08 0,0 97.79,0 97.79,45.72 48.26,45.72 48.26,41.91 49.53,40.64 54.61,40.64 55.88,41.91 87.63,41.91 88.9,40.64 88.9,36.83 92.71,33.02 92.71,6.35 91.44,5.08
D1_N
  Bottom 0.152: C22.2 13.97,11.8 13.49,11.32 13.49,10.91 13.66,10.73 13.66,8.81 13.9,8.58 DS1.8
D1_P
  Bottom 0.152: C18.2 12.7,11.26 13.36,10.61 13.36,9.24 13.17,9.05 12.98,9.05 DS1.9
D2_N
  Bottom 0.152: C28.2 40.64,11.8 40.16,11.32 40.16,10.91 40.33,10.73 40.33,8.81 40.57,8.58 DS2.8
D2_P
  Bottom 0.152: C24.2 39.37,11.26 40.03,10.61 40.03,9.24 39.84,9.05 39.65,9.05 DS2.9
D3_N
  Bottom 0.152: C23.2 67.31,11.8 66.83,11.32 66.83,10.91 67,10.73 67,8.81 67.24,8.58 DS3.8
D3_P
  Bottom 0.152: C19.2 66.04,11.26 66.7,10.61 66.7,9.24 66.51,9.05 66.32,9.05 DS3.9
D4_N
  Bottom 0.152: C29.2 85.99,13.97 86.47,13.49 86.88,13.49 87.06,13.66 88.98,13.66 89.21,13.9 DS4.8
D4_P
  Bottom 0.152: C25.2 86.53,12.7 87.19,13.36 88.55,13.36 88.74,13.17 88.74,12.98 DS4.9
DS1_AMBER/ACA_DOCK  (via drill 0.35)
  Top 0.203: D2.A 3.81,10.39 v3.81,12.7 4.66,12.7 R3.1
  Bottom 0.203: U2.2 57.52,29.2 59.05,30.74 59.05,31.11 59.69,31.75 59.69,36.83 58.42,38.1 29.21,38.1 v3.81,12.7
DS1_D_N  (via drill 0.35)
  Route15 0.203: v50.79,36.84 50.79,36.32 49.14,34.67 34.17,34.67 16.33,16.84 16.33,9.62 15.65,8.94 15.65,7.22 DS1.2
  Bottom 0.203: v50.79,36.84 50.79,34.04 50.27,33.52 U2.73
DS1_D_P  (via drill 0.35)
  Route15 0.203: v51.44,36.2 51.17,36.2 49.29,34.31 34.31,34.31 16.69,16.69 16.69,9.62 17.37,8.94 17.37,7.22 DS1.3
  Bottom 0.203: v51.44,36.2 51.18,35.94 51.18,33.91 50.67,33.4 U2.74
DS1_GREEN/PORT_DISABLE[0]  (via drill 0.35)
  Top 0.203: D3.A 2.54,7.39 v2.54,7.62 2.54,13.12 R4.1
  Bottom 0.203: U2.3 57.04,28.84 57.66,28.84 60.05,31.23 60.05,36.98 58.57,38.46 29.06,38.46 3.94,13.33 3.55,13.33 2.54,12.32 v2.54,7.62
DS1_LED_SS/PORT_DISABLE[1]  (via drill 0.35)
  Top 0.203: D4.A 2.54,3.58 v2.54,3.81 2.54,6.73 1.91,7.36 1.91,12.99 2.54,13.62 R5.1
  Bottom 0.203: U2.4 57.04,28.44 57.76,28.44 60.4,31.08 60.4,37.12 58.72,38.81 28.91,38.81 3.79,13.69 3.4,13.69 1.91,12.2 1.91,7.36 2.54,6.73 v2.54,3.81
DS1_OVRCURR  (via drill 0.35)
  Top 0.203: v8.89,36.83 R37.1
  Route2 0.203: v46.35,19.66 34.45,19.66 29.57,24.54 24.7,24.54 16.58,32.66 16.58,35.11 14.86,36.83 v8.89,36.83
  Bottom 0.203: U2.42 48.63,20.43 48.63,19.5 48.02,18.89 47.5,18.89 46.73,19.66 v46.35,19.66
DS1_PWREN/CDP_EN  (via drill 0.35)
  Top 0.203: v8.89,34.29 R32.1
  Route2 0.203: v46.35,17.78 35.32,17.78 29.28,23.82 24.41,23.82 15.87,32.36 15.87,33.28 14.86,34.29 v8.89,34.29
  Bottom 0.203: U2.38 50.23,20.43 50.23,19.9 48.11,17.78 v46.35,17.78
DS1_RX_N
  Bottom 0.203: DS1.5 20.51,10.35 37.36,27.2 U2.60
DS1_RX_P
  Bottom 0.203: DS1.6 18.51,8.85 37.26,27.6 U2.61
DS1_TX_N  (via drill 0.35)
  Top 0.203: v36.47,27.94 36.47,27.03 v37.28,26.22
  Bottom 0.203: U2.58 37.45,26.4 v37.28,26.22 | C22.1 13.97,14.51 14.7,15.24 23.36,15.24 35.43,27.31 35.82,27.31 36.45,27.94 v36.47,27.94
DS1_TX_P  (via drill 0.35)
  Top 0.203: v35.56,27.94 35.56,26.66 v36.63,25.58
  Bottom 0.203: U2.57 38.59,26 38.17,25.58 v36.63,25.58 | C18.1 12.7,14.51 13.79,15.6 23.22,15.6 v35.56,27.94
DS2_AMBER/NON_REMOVABLE[0]  (via drill 0.35)
  Top 0.203: D5.A 30.25,19.28 27.94,21.59 27.94,26.67 v21.59,33.02 22.86,31.75 R6.1
  Bottom 0.203: U2.5 57.04,28.04 57.86,28.04 60.76,30.93 60.76,37.27 58.86,39.17 27.74,39.17 v21.59,33.02
DS2_D_N  (via drill 0.35)
  Route15 0.203: DS2.2 42.32,7.22 42.32,8.94 43,9.62 43,10.34 41.91,11.43 41.91,23.12 40.28,24.75 40.28,31.9 41.76,33.38 47.9,33.38 49.16,32.12 50.77,32.12 51.04,32.38 51.08,32.38 51.09,32.39 v51.95,32.39
  Bottom 0.203: U2.77 51.87,31.16 51.95,31.24 v51.95,32.39
DS2_D_P  (via drill 0.35)
  Route15 0.203: DS2.3 44.04,7.22 44.04,8.94 43.36,9.62 43.36,10.48 42.27,11.58 42.27,23.29 40.64,24.91 40.64,31.75 41.91,33.02 47.76,33.02 49.02,31.76 50.79,31.76 50.8,31.75 v51.3,31.75
  Bottom 0.203: v51.3,31.75 51.47,31.58 U2.76
DS2_GREEN/NON_REMOVABLE[1]  (via drill 0.35)
  Top 0.203: D6.A 30.25,7.85 29.4,8.7 29.4,10.96 29.89,11.46 29.89,19.13 27.58,21.44 27.58,25.76 v21.27,32.06 21.27,32.44 20.96,32.76 20.96,33.28 21.33,33.65 25.18,33.65 R7.1
  Bottom 0.203: U2.6 57.04,27.64 57.96,27.64 61.11,30.79 61.11,37.42 59.01,39.52 27.2,39.52 20.96,33.28 20.96,32.76 21.27,32.44 v21.27,32.06
DS2_LED_SS/PWR_EN_SEL  (via drill 0.35)
  Top 0.203: v54.62,31.37 54.23,30.99 49.15,30.99 47.63,32.51 47.63,34.8 47.39,35.03 34.29,35.03 | 34.29,35.03 28.47,35.03 25.53,37.97 25.02,37.97 20.57,33.53 20.57,31.75 27.23,25.09 27.23,21.29 29.54,18.98 29.54,11.61 29.04,11.11 29.04,3.98 30.25,2.77 D7.A | R8.1 34.29,35.14 34.29,35.03
  Bottom 0.203: v54.62,31.37 54.67,31.32 U2.84
DS2_OVRCURR  (via drill 0.35)
  Top 0.203: R38.1 v58.42,31.11
  Bottom 0.203: U2.1 57.41,29.6 58.42,30.61 v58.42,31.11
DS2_PWREN/CDP_EN
  Bottom 0.203: R33.1 55.23,34.52 55.77,34.52 56.87,33.43 56.87,32.61 55.61,31.34 55.61,30.96 55.47,30.83 U2.86
DS2_RX_N
  Bottom 0.203: DS2.5 47.18,9.2 43.18,13.2 43.18,23.25 44.75,24.82 46.06,24.82 46.08,24.8 U2.54
DS2_RX_P
  Bottom 0.203: DS2.6 45.18,10.7 42.82,13.06 42.82,23.4 44.61,25.18 46.06,25.18 46.08,25.2 U2.55
DS2_TX_N  (via drill 0.35)  (1 unrouted)
  Top 0.203: v45.08,24.13 44.19,24.13 43.69,24.64 v43.69,25.27
  Bottom 0.203: C28.1 40.64,14.51 40.18,14.96 40.18,22.4 41.91,24.13 42.55,24.13 43.06,24.64 43.43,25.01 43.43,25.02 v43.69,25.27 | v45.08,24.13 v45.09,24.13 46.58,24.13 46.67,24.04 46.99,24.04
DS2_TX_P  (via drill 0.35)  (1 unrouted)
  Top 0.203: v42.8,25.27 42.8,25 44.31,23.49 v44.44,23.49
  Bottom 0.203: C24.1 39.37,14.51 39.83,14.96 39.83,22.55 42.55,25.27 v42.8,25.27 | v44.44,23.49 46.6,23.49 46.67,23.56 46.87,23.56 46.95,23.64 46.99,23.64
DS3_AMBER/VID_SEL[2]  (via drill 0.35)
  Top 0.203: D8.C 56.92,15.01 58.6,16.7 58.6,21.59 | v52.07,33.3 53.37,32 56.54,32 58.6,29.94 58.6,21.59 | R22.1 59.88,20.32 58.6,21.59
  Bottom 0.203: U2.85 55.07,30.93 55.25,31.11 55.25,31.49 56.51,32.75 56.51,33.28 55.63,34.17 53.31,34.17 52.45,33.3 v52.07,33.3
DS3_D_N  (via drill 0.35)
  Route2 0.203: v53.19,33.15 54.33,32 67.06,32 71.12,27.94 71.12,13.2 69.67,11.76 69.67,9.62 68.99,8.94 68.99,7.22 DS3.2
  Bottom 0.203: U2.78 52.27,31.06 52.3,31.09 52.3,31.85 52.96,32.51 52.96,32.92 v53.19,33.15
DS3_D_P  (via drill 0.35)
  Route2 0.203: v54.08,33.15 54.08,32.77 54.49,32.36 67.2,32.36 71.48,28.09 71.48,13.06 70.03,11.61 70.03,9.62 70.71,8.94 70.71,7.22 DS3.3
  Bottom 0.203: v54.08,33.15 54.08,33.13 52.67,31.72 U2.79
DS3_GREEN/VID_SEL[1]  (via drill 0.35)
  Top 0.203: D9.C 51.84,11.43 47.88,11.43 43.69,15.62 39.62,15.62 39.37,15.88 v39.37,29.21 36.41,32.17 R23.1
  Bottom 0.203: v39.37,29.21 39.78,28.8 U2.64
DS3_LED_SS/PIN_STRAP  (via drill 0.35)
  Top 0.203: D10.C 55.88,3.58 55.88,6.89 51.69,11.07 47.73,11.07 43.54,15.27 39.48,15.27 39.01,15.73 39.01,27.96 v38.74,28.23 36.49,30.48 R24.1
  Bottom 0.203: v38.74,28.23 46.54,28.23 46.67,28.36 47.1,28.36 U2.63
DS3_OVRCURR  (via drill 0.35)
  Top 0.203: v46.37,30.05 46.37,32.74 R39.1
  Bottom 0.203: U2.65 47.1,29.24 46.67,29.24 46.37,29.54 v46.37,30.05
DS3_PWREN/CDP_EN
  Bottom 0.152: 56.2,31.43 55.94,31.17 55.94,30.83 55.87,30.76 U2.87
  Bottom 0.203: R34.1 58.42,34.29 58.42,33.02 57.15,31.75 56.52,31.75 56.2,31.43
DS3_RX_N
  Bottom 0.203: U2.46 46.31,21.6 46.26,21.56 46.16,21.56 45.36,20.76 45.36,16.36 47.22,14.5 67.77,14.5 70.71,11.56 70.71,8.51 71.5,7.72 72.74,7.72 73.6,8.58 DS3.5
DS3_RX_P
  Bottom 0.203: U2.45 46.31,21.2 45.72,20.61 45.72,16.51 47.37,14.86 67.91,14.86 71.06,11.71 71.06,10.32 71.85,9.54 DS3.6
DS3_TX_N
  Bottom 0.203: U2.49 45.16,22.8 44.09,21.74 44.09,15.9 46.8,13.19 64.69,13.19 65.14,12.75 66.7,12.75 67.31,13.36 C23.1
DS3_TX_P
  Bottom 0.203: U2.48 45.26,22.4 44.45,21.59 44.45,16.05 46.95,13.55 C19.1
DS4_AMBER/I2C_DEV_ID  (via drill 0.35)
  Top 0.203: D12.A 86.49,3.58 78.74,11.33 78.74,15.24 76.2,17.78 | 76.2,17.78 v60.6,17.78 | 76.2,17.78 74.51,19.47 R26.1
  Bottom 0.203: U2.30 53.47,18.92 55.24,17.15 59.95,17.15 60.58,17.78 v60.6,17.78
DS4_D_N  (via drill 0.35)
  Route2 0.203: v55.88,33.02 80.01,33.02 81.28,31.75 81.28,24.9 82.55,23.63 82.55,19.82 86.03,16.33 88.17,16.33 88.86,15.65 90.57,15.65 DS4.2
  Bottom 0.203: v55.88,33.02 55.37,33.02 53.87,31.52 U2.82
DS4_D_P  (via drill 0.35)
  Route2 0.203: v54.98,33.54 55.11,33.66 56.23,33.66 56.52,33.38 80.16,33.38 81.64,31.9 81.64,25.04 82.91,23.77 82.91,19.96 86.18,16.69 88.17,16.69 88.86,17.37 90.57,17.37 DS4.3
  Bottom 0.203: v54.98,33.54 54.98,33.16 53.47,31.64 U2.81
DS4_GREEN/VID_SEL[0]  (via drill 0.35)
  Top 0.203: D11.C 90.59,2.73 86.83,2.73 78.38,11.17 78.38,15.09 76.05,17.42 61.53,17.42 v61.25,17.15 | v15.24,38.1 R25.1
  Route2 0.203: v47.76,19.52 47.39,19.89 47.01,19.89 46.58,20.32 34.29,20.32 29.72,24.89 24.85,24.89 16.94,32.8 16.94,35.26 15.24,36.96 v15.24,38.1
  Route15 0.203: v47.76,19.52 50.56,16.73 58.05,16.73 58.66,16.12 60.23,16.12 v61.25,17.15
  Bottom 0.203: U2.43 48.27,19.95 47.84,19.52 v47.76,19.52
DS4_LED_SS  (via drill 0.35)
  Top 0.203: D13.A 93.1,3.58 91.89,2.37 86.68,2.37 78.03,11.02 78.03,14.95 75.91,17.07 62.07,17.07 61.51,16.52 60.95,16.52 v59.69,17.78
  Bottom 0.203: U2.26 55.07,19.86 57.15,17.78 v59.69,17.78
DS4_OVRCURR  (via drill 0.35)
  Top 0.203: v15.24,33.02 R40.1
  Route2 0.203: v47.01,17.15 35.45,17.15 29.13,23.47 25.4,23.47 25.32,23.47 24.26,23.47 15.24,32.49 v15.24,33.02
  Bottom 0.203: U2.36 51.07,19.67 51.43,19.31 51.43,18.79 51.06,18.42 49.25,18.42 47.98,17.15 v47.01,17.15
DS4_PWREN/CDP_EN  (via drill 0.35)
  Top 0.203: v8.89,31.75 R35.1
  Route2 0.203: v46.99,16.24 46.72,16.51 35.59,16.51 28.98,23.11 25.4,23.11 25.17,23.11 24.11,23.11 15.48,31.75 v8.89,31.75
  Bottom 0.203: U2.35 51.47,19.78 51.79,19.46 51.79,18.64 51.21,18.06 49.4,18.06 47.58,16.24 v46.99,16.24
DS4_RX_N
  Bottom 0.203: DS4.5 87.44,20.51 85.55,22.4 U2.19
DS4_RX_P
  Bottom 0.203: DS4.6 88.94,18.51 85.45,22 U2.20
DS4_TX_N  (via drill 0.35)
  Top 0.203: v81.28,23.03 81.03,22.78 81.03,21.62 v81.28,21.37
  Bottom 0.203: C29.1 82.55,13.97 81.28,15.24 v81.28,21.37 | v81.28,23.03 80.26,23.03 80.1,23.2 U2.17
DS4_TX_P  (via drill 0.35)
  Top 0.203: v80.53,23.8 80.62,23.7 80.62,21.62 v80.37,21.37
  Bottom 0.203: C25.1 83.32,12.7 80.92,15.09 80.92,20.82 v80.37,21.37 | v80.53,23.8 79.76,23.8 79.56,23.6 U2.16
GND  (via drill 0.2 pad 0.41, 0.65)
  Top 0.61: U1.2 v59.69,41.91
  Bottom 0.203: U2.50 47.97,23.2 v48.01,23.24
  other vias: 52.07,25.4 52.07,27.94 53.34,26.67 54.61,26.67 53.34,25.4 54.61,24.13 53.34,24.13 52.07,24.13 52.07,22.86 50.8,24.13 49.53,24.13 50.8,25.4 50.8,26.67 49.53,26.67 53.34,27.94 53.34,22.86 50.8,22.86 50.8,27.94
  pour Top (rank 6): -2.54,-2.54 104.14,-2.54 104.14,53.34 -2.54,53.34
  pour Bottom (rank 6): -3.81,-1.27 -3.81,54.61 102.87,54.61 102.87,-1.27
  pour Route2 (rank 6): -1.27,-3.81 -1.27,52.07 105.41,52.07 105.41,-3.81
  pour Route15 (rank 6): -5.08,-5.08 106.68,-5.08 106.68,55.88 -5.08,55.88
  pour Route15: 52.32,19.56 50.8,21.08 50.8,22.23 52.7,24.13 52.7,28.45 52.45,28.7 47.62,28.7 47.12,29.21 46.23,29.21 46.23,19.56
  pour Top (no thermals): 46.99,30.48 46.99,20.32 57.15,20.32 57.15,30.48
MODE_SEL[0]  (via drill 0.35)
  Top 0.203: R29.1 v15.24,27.94
  Route2 0.203: v55.51,17.78 54.8,17.07 49.84,17.07 48.26,15.49 48.26,12.7 45.72,10.16 39.37,10.16 36.83,12.7 36.83,13.76 28.54,22.05 23.67,22.05 17.78,27.94 v15.24,27.94
  Bottom 0.203: v55.51,17.78 55.5,17.8 55.5,18.68 54.27,19.91 U2.28
MODE_SEL[1]  (via drill 0.35)
  Top 0.203: R30.1 v8.89,29.21
  Route2 0.203: v54.87,18.42 53.87,17.42 49.68,17.42 45.87,13.61 37.48,13.61 28.69,22.4 25.4,22.4 24.88,22.4 23.82,22.4 17.01,29.21 v8.89,29.21
  Bottom 0.203: U2.29 53.87,19.41 v54.87,18.42
N$7  (1 unrouted)
N$8
  Top 0.203: D14.C 80.63,40.41 R36.2
N$9  (via drill 0.2 pad 0.41)
  other vias: 52.07,26.67
N$11  (via drill 0.35)  (1 unrouted)
  Bottom 0.203: R9.1 5.93,11.01 v6.35,11.43
N$15  (via drill 0.35)
  Top 0.203: v33.02,11.43 33.25,11.2 D5.C
  Bottom 0.203: R12.1 32.6,11.01 v33.02,11.43
N$16  (via drill 0.35)
  Top 0.203: v6.35,7.62 6.58,7.39 D3.C
  Bottom 0.203: R10.1 5.93,7.2 v6.35,7.62
N$20  (via drill 0.35)
  Top 0.203: D6.C 33.25,7.39 v33.02,7.62
  Bottom 0.203: v33.02,7.62 32.6,7.2 R13.1
N$21  (via drill 0.35)
  Top 0.203: v6.35,3.81 6.58,3.58 D4.C
  Bottom 0.203: R11.1 5.93,3.39 v6.35,3.81
N$23  (via drill 0.35)
  Top 0.203: D7.C 33.25,3.58 v33.02,3.81
  Bottom 0.203: v33.02,3.81 32.6,3.39 R14.1
N$24  (via drill 0.35)
  Top 0.203: D10.A 59.92,3.58 v59.69,3.81
  Bottom 0.203: v59.69,3.81 59.27,3.39 R19.1
N$25  (via drill 0.35)
  Top 0.203: v59.69,7.62 59.92,7.39 D9.A
  Bottom 0.203: R18.1 59.27,7.2 v59.69,7.62
N$26  (via drill 0.35)
  Top 0.203: D8.A 59.92,11.2 v59.69,11.43
  Bottom 0.203: v59.69,11.43 59.27,11.01 R17.1
N$27  (via drill 0.35)
  Top 0.203: v86.36,6.35 86.59,6.58 D12.C
  Bottom 0.203: R27.1 86.78,5.93 v86.36,6.35
N$28
  Top 0.61: U3.5 50.48,38.2 L2.P$1
N$29  (via drill 0.35)
  Top 0.203: v93.98,6.35 94.21,6.58 D13.C
  Bottom 0.203: R28.1 94.4,5.93 v93.98,6.35
N$30
  Top 0.61: U1.3 58.77,43.18 59.81,43.18 60.67,42.32 60.67,40.58 59.58,39.48 L1.P$1
N$32  (via drill 0.35)
  Top 0.203: v90.17,6.35 90.4,6.58 D11.A
  Bottom 0.203: R20.1 90.59,5.93 v90.17,6.35
N$36  (via drill 0.35)
  Route15 0.203: v60.96,39.37 60.96,21.59 60.13,20.77 v57.97,20.77
  Bottom 0.203: R46.1 R47.1 61.38,38.95 v60.96,39.37 | v57.97,20.77 57.54,21.2 U2.22
N$37
  Bottom 0.203: R41.2 C30.1 US.SHIELD1
N$38
  Bottom 0.203: C31.1 R42.2 21.82,3.81 DS1.SHIELD1
N$39
  Bottom 0.203: C32.1 R43.2 48.49,3.81 DS2.SHIELD1
N$40
  Bottom 0.203: C33.1 R44.2 75.17,3.81 DS3.SHIELD1
N$41
  Bottom 0.203: C34.1 R45.2 93.98,21.82 DS4.SHIELD1
PWR_SW_POL  (via drill 0.35)
  Top 0.203: R31.1 v15.24,30.48
  Route2 0.203: v53.3,18.19 52.89,17.78 49.53,17.78 45.72,13.97 37.62,13.97 28.83,22.76 25.4,22.76 25.02,22.76 23.97,22.76 16.25,30.48 v15.24,30.48
  Bottom 0.203: U2.31 53.07,18.43 v53.3,18.19
RESETIN  (via drill 0.35)
  Top 0.203: C2.1 R1.1 62.32,39.04 SW1.D 64.63,38.24 v66.04,36.83
  Route15 0.203: v66.04,36.83 66.04,21.59 63.5,19.05 v50.8,19.05
  Bottom 0.203: v50.8,19.05 50.67,19.18 U2.37
RREF_SS  (via drill 0.35)
  Top 0.203: R15.2 53.12,15.88 v53.34,16.09
  Bottom 0.203: U2.32 52.67,16.77 v53.34,16.09
RREF_USB2
  Bottom 0.203: U2.7 58.7,27.2 60.71,29.21 R16.2
SUSPEND  (via drill 0.35)
  Top 0.203: 64.52,35.58 D1.A 64.54,36.6 v64.77,36.83
  Route15 0.203: v57.54,19.91 57.76,20.14 63.31,20.14 64.77,21.59 v64.77,36.83
  Bottom 0.203: U2.25 55.51,20.43 55.51,20 55.72,19.79 57.03,19.79 57.15,19.91 v57.54,19.91
US_D_N  (via drill 0.35)
  Route2 0.203: US.2 88.91,35.94 86,35.94 85.09,35.03 58.02,35.03 57.66,34.67 50.69,34.67 49.16,36.2 v48.9,36.2
  Bottom 0.203: v48.9,36.2 48.9,34.04 49.87,33.08 U2.72
US_D_P  (via drill 0.35)
  Route2 0.203: US.3 90.31,34.62 88.58,34.62 87.62,35.58 86.15,35.58 85.24,34.67 58.17,34.67 57.78,34.29 50.55,34.29 49.28,35.56 v48.26,35.56
  Bottom 0.203: v48.26,35.56 48.51,35.31 48.51,33.91 49.47,32.95 U2.71
US_N
  Bottom 0.203: US.5 86.42,31.73 86.42,29.27 84.63,27.48 63.73,27.48 62.84,26.59 62.32,26.59 61.86,27.05 C15.2
US_OVRCURR  (via drill 0.35)
  Top 0.203: v15.24,35.56 R21.1
  Route2 0.203: v46.74,18.76 34.85,18.76 29.42,24.18 24.56,24.18 16.23,32.51 16.23,33.43 15.24,34.42 v15.24,35.56
  Bottom 0.203: U2.39 49.83,20.43 49.83,20 48.36,18.53 47.35,18.53 47.13,18.76 v46.74,18.76
US_P
  Bottom 0.203: US.6 88.13,33.47 88.13,32.23 86.77,30.87 86.77,29.12 84.78,27.13 63.88,27.13 62.53,25.78 C17.2
US_RX_N  (via drill 0.35)
  Top 0.203: v83.82,28.11 v83.82,26.44
  Bottom 0.203: U2.13 62.9,24.8 64.54,26.44 v83.82,26.44 | US.8 86.07,39.33 83.82,37.08 v83.82,28.11
US_RX_P  (via drill 0.35)
  Top 0.203: v83.19,25.78 83.19,27.84 v82.91,28.11
  Bottom 0.203: U2.14 63,24.4 64.64,26.04 82.93,26.04 v83.19,25.78 | US.9 83.42,37.23 83.42,28.62 v82.91,28.11
US_TX_N
  Bottom 0.152: 60.06,27.05 C15.1
  Bottom 0.203: C15.1 59.94,27.05 58.89,26 U2.10
US_TX_P
  Bottom 0.203: C17.1 59.22,25.78 59.04,25.6 U2.11
XTL_IN
  Bottom 0.203: 45.47,32 47.53,32 48.67,30.86 U2.69 | 45.47,32 45.25,32.22 Q1.P$1 | 45.47,32 42.51,32 C13.1
XTL_OUT
  Bottom 0.203: 43.94,31.46 47.57,31.46 48.27,30.76 U2.68 | Q1.P$3 43.65,31.17 43.94,31.46 | 43.94,31.46 42.47,31.46 C12.1

### Text on the board
tPlace: HX3 CYUSB 3.0 HUB | Ethan Kessel